# Altium schematic sheet rx5808.SchDoc
size A4
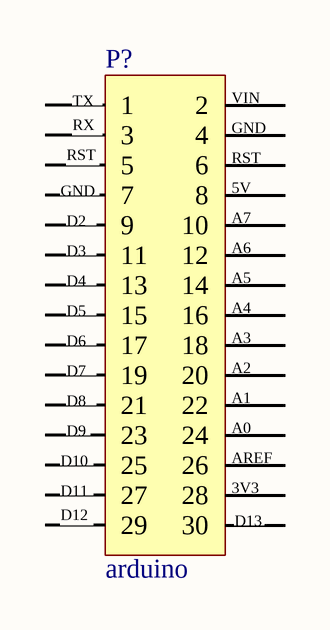
[diagram p0: rx5808.SchDoc]

## Parts
P?  arduino  [HDR2X15]

## Nets

Not connected (* = marked no-connect by the designer): P? 1 2 3 4 5 6 7 8 9 10 11 12 13 14 15 16 17 18 19 20 21 22 23 24 25 26 27 28 29 30

## Notes on the sheet
- (near P?) GND
- (near P?) RST
- (near P?) TX
- (near P?) RX
- (near P?) VIN
- (near P?) 5V
- (near P?) D2
- (near P?) D3
- (near P?) D4
- (near P?) D5
- (near P?) D6
- (near P?) A7
- (near P?) A6
- (near P?) A5
- (near P?) A4
- (near P?) A3
- (near P?) D10
- (near P?) D11
- (near P?) D7
- (near P?) D8
- (near P?) D9
- (near P?) A2
- (near P?) A1
- (near P?) A0
- (near P?) AREF
- (near P?) 3V3
- (near P?) D12
- (near P?) D13

## Library data of the parts
P? = Header 15X2: Header, 15-Pin, Dual row; LatestRevisionDate: 17-Jul-2002; LatestRevisionNote: Re-released for DXP Platform.; Publisher: Altium Limited